# EAGLE design cortex-mpu (EAGLE 7.3.0)
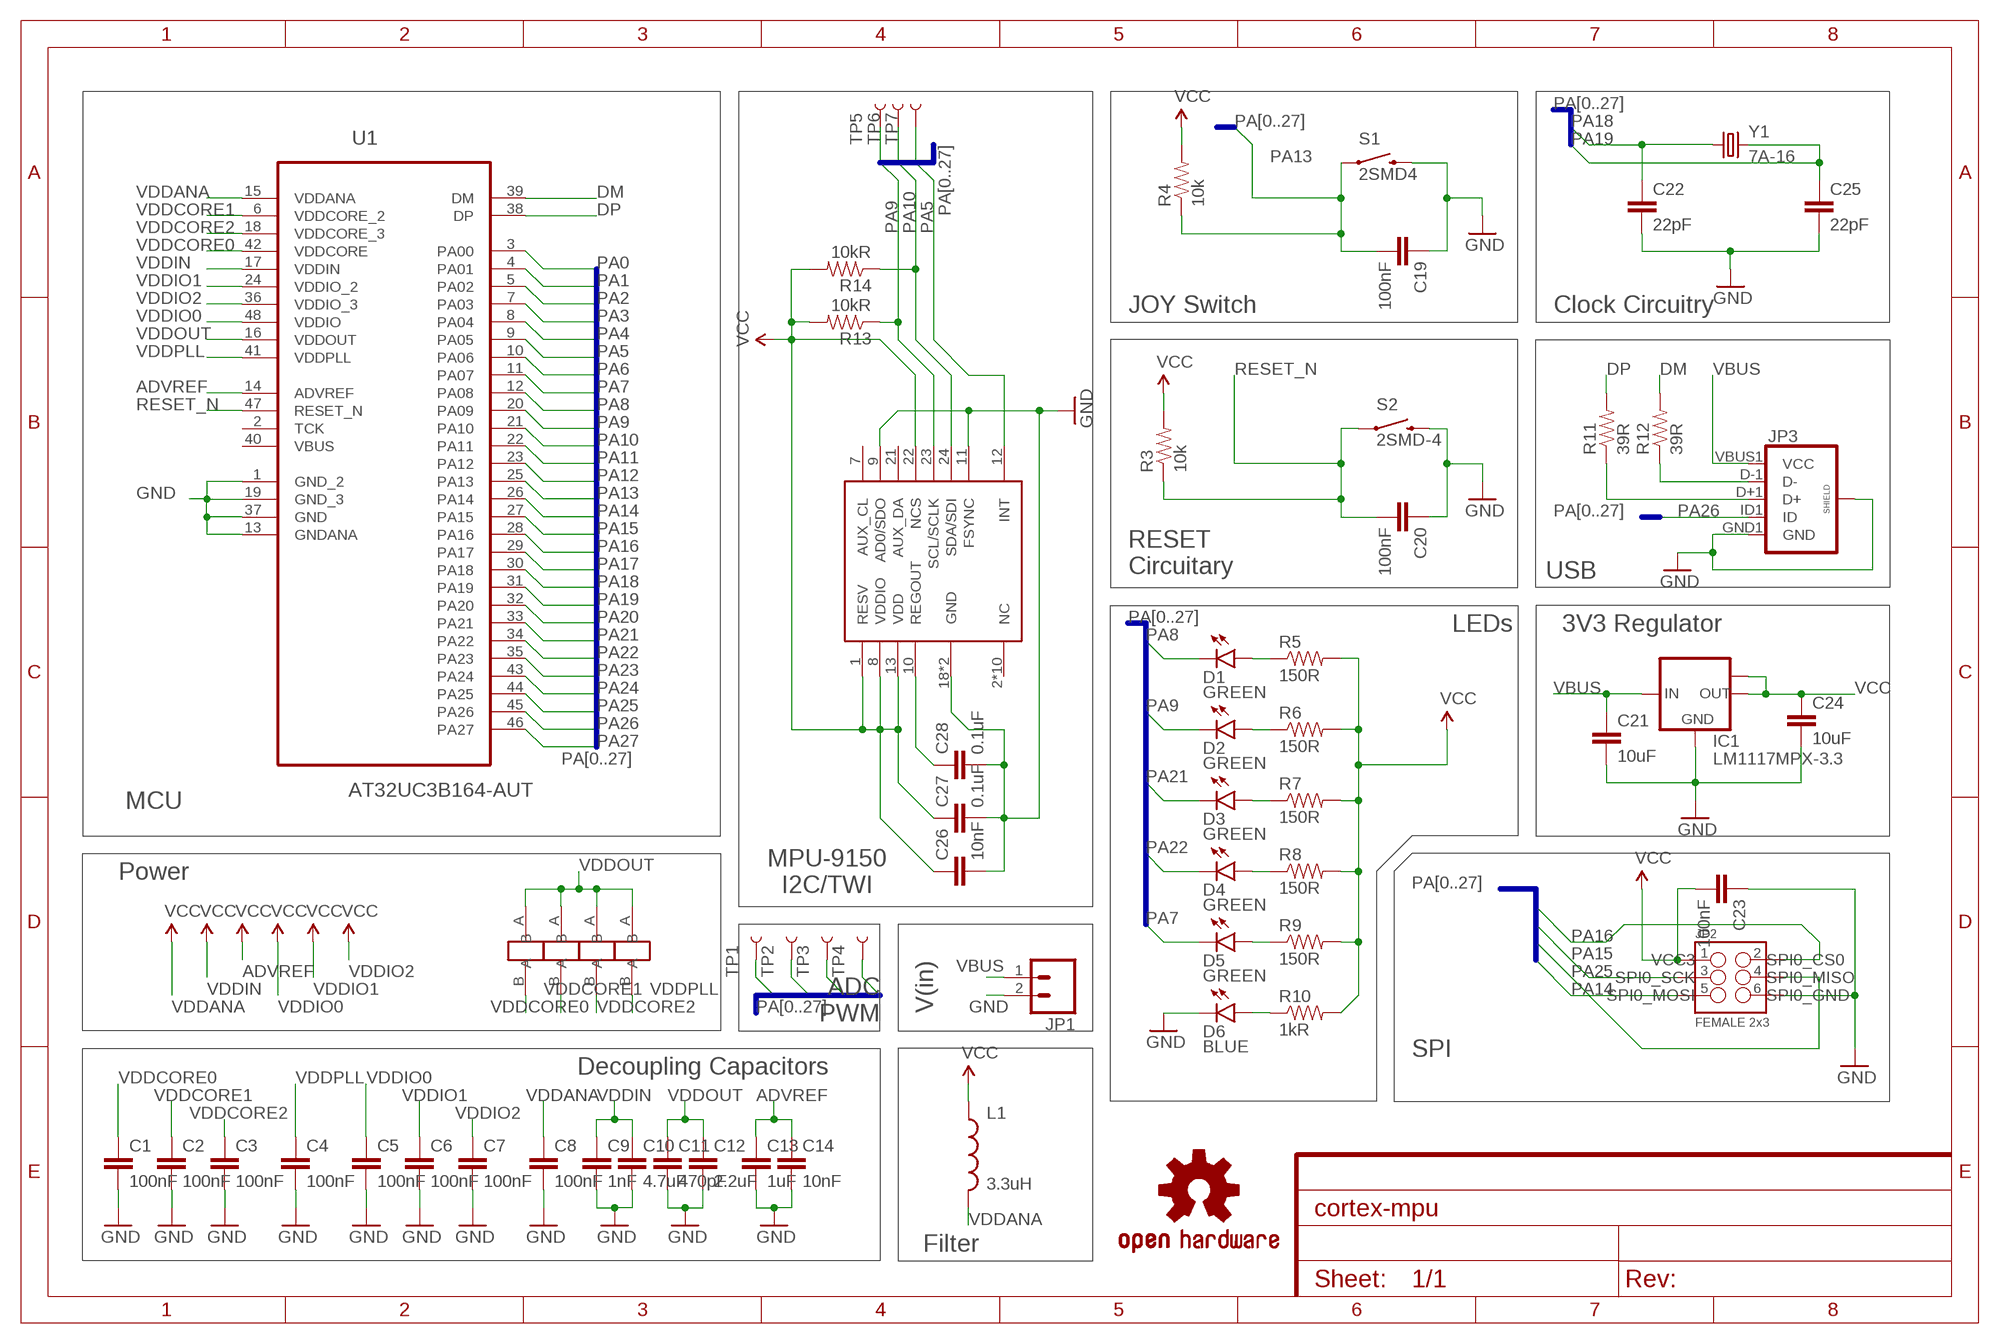
[diagram p0: schematic, sheet 1]
FRAME1 (FRAME-A4L): CNAME: AVR32 and MPU Interface; CREVISION: 1; DESIGNER: Prashant Sinha

## Parts
C1  100nF  CAP0603-CAP  [0603-CAP]
C2  100nF  CAP0603-CAP  [0603-CAP]
C3  100nF  CAP0603-CAP  [0603-CAP]
C4  100nF  CAP0603-CAP  [0603-CAP]
C5  100nF  CAP0603-CAP  [0603-CAP]
C6  100nF  CAP0603-CAP  [0603-CAP]
C7  100nF  CAP0603-CAP  [0603-CAP]
C8  100nF  CAP0603-CAP  [0603-CAP]
C9  1nF  CAP0603-CAP  [0603-CAP]
C10  4.7uF  CAP0603-CAP  [0603-CAP]
C11  470pF  CAP0603-CAP  [0603-CAP]
C12  2.2uF  CAP0603-CAP  [0603-CAP]
C13  1uF  CAP0603-CAP  [0603-CAP]
C14  10nF  CAP0603-CAP  [0603-CAP]
C19  100nF  CAP0603-CAP  [0603-CAP]
C20  100nF  CAP0603-CAP  [0603-CAP]
C21  10uF  CAP0603-CAP  [0603-CAP]
C22  22pF  CAP0603-CAP  [0603-CAP]
C23  100nF  CAP0603-CAP  [0603-CAP]
C24  10uF  CAP0603-CAP  [0603-CAP]
C25  22pF  CAP0603-CAP  [0603-CAP]
C26  10nF  CAP0603-CAP  [0603-CAP]
C27  0.1uF  CAP0603-CAP  [0603-CAP]
C28  0.1uF  CAP0603-CAP  [0603-CAP]
D1  GREEN  LED-GREEN0603  [LED-0603]
D2  GREEN  LED-GREEN0603  [LED-0603]
D3  GREEN  LED-GREEN0603  [LED-0603]
D4  GREEN  LED-GREEN0603  [LED-0603]
D5  GREEN  LED-GREEN0603  [LED-0603]
D6  BLUE  LED-BLUE0603  [LED-0603]
IC1  LM1117MPX-3.3  [SOT223]
JP1  M02LOCK  [1X02_LOCK]
JP2  FEMALE 2x3  M03X2FEMALE  [2X3]
JP3  USB_MICROB_PLUGCONN-11752  [USB-B-MICRO-SMD_V03]
L1  3.3uH  INDUCTOR0603  [0603]
LOGO1  OSHW-LOGOS-COPPER  [OSHW-LOGO-S_COPPER]
R3  10k  RESISTOR0603-RES  [0603-RES]
R4  10k  RESISTOR0603-RES  [0603-RES]
R5  150R  RESISTOR0603-RES  [0603-RES]
R6  150R  RESISTOR0603-RES  [0603-RES]
R7  150R  RESISTOR0603-RES  [0603-RES]
R8  150R  RESISTOR0603-RES  [0603-RES]
R9  150R  RESISTOR0603-RES  [0603-RES]
R10  1kR  RESISTOR0603-RES  [0603-RES]
R11  39R  RESISTOR0603-RES  [0603-RES]
R12  39R  RESISTOR0603-RES  [0603-RES]
R13  10kR  RESISTOR0603-RES  [0603-RES]
R14  10kR  RESISTOR0603-RES  [0603-RES]
S1  2SMD4  SWITCH-MOMENTARY-2SMD-4  [TACTILE_SWITCH_TALL]
S2  2SMD-4  SWITCH-MOMENTARY-2SMD-4  [TACTILE_SWITCH_TALL]
TP1  TEST-POINT2  [PAD.02X.02]
TP2  TEST-POINT2  [PAD.02X.02]
TP3  TEST-POINT2  [PAD.02X.02]
TP4  TEST-POINT2  [PAD.02X.02]
TP5  TEST-POINT2  [PAD.02X.02]
TP6  TEST-POINT2  [PAD.02X.02]
TP7  TEST-POINT2  [PAD.02X.02]
U1  AT32UC3B164-AUT  [QFP50P900X900X120-48N]
U$1  JUNCTION  [JUN-2]
U$2  JUNCTION  [JUN-2]
U$3  JUNCTION  [JUN-2]
U$4  JUNCTION  [JUN-2]
U$5  MPU-9250  [QFN-24-3MM]
Y1  7A-16  CRYSTALTXC-7A  [CRYSTAL-TXC-7A]

## Nets
ADVREF: C13.1 C14.1 U1.14(ADVREF) ; supply symbol labelled VCC
DM: R12.2 U1.39(DM)
DP: R11.2 U1.38(DP)
GND: C1.2 C2.2 C3.2 C4.2 C5.2 C6.2 C7.2 C8.2 C9.2 C10.2 C11.2 C12.2 C13.2 C14.2 C19.1 C20.1 C21.2 C22.2 C23.1 C24.2 C25.2 C26.2 C27.2 C28.2 D6.C IC1.1(GND) JP1.2 JP2.6 JP3.GND1(GND) JP3.SHIELD1(SHIELD) JP3.SHIELD2(SHIELD) JP3.SHIELD3(SHIELD) S1.B2 S2.B2 U1.1(GND_2) U1.13(GNDANA) U1.19(GND_3) U1.37(GND) U$5.9(AD0/SDO) U$5.11(FSYNC) U$5.18(GND) U$5.20(GND)
N$1: JP3.D-1(D-) R12.1
N$2: JP3.D+1(D+) R11.1
N$3: D1.A R5.1
N$4: D2.A R6.1
N$5: D6.A R10.1
N$6: D3.A R7.1
N$7: D4.A R8.1
N$8: D5.A R9.1
N$17: C28.1 U$5.10(REGOUT)
PA0: U1.3(PA00)
PA1: U1.4(PA01)
PA2: U1.5(PA02)
PA3: TP3.P$1 U1.7(PA03)
PA4: TP4.P$1 U1.8(PA04)
PA5: TP7.P$1 U1.9(PA05) U$5.12(INT)
PA6: U1.10(PA06)
PA7: D5.C U1.11(PA07)
PA8: D1.C U1.12(PA08)
PA9: D2.C R13.1 TP5.P$1 U1.20(PA09) U$5.23(SCL/SCLK)
PA10: R14.1 TP6.P$1 U1.21(PA10) U$5.24(SDA/SDI)
PA11: U1.22(PA11)
PA12: U1.23(PA12)
PA13: C19.2 R4.1 S1.A2 U1.25(PA13)
PA14: JP2.5 U1.26(PA14)
PA15: JP2.3 U1.27(PA15)
PA16: JP2.2 U1.28(PA16)
PA17: U1.29(PA17)
PA18: C22.1 U1.30(PA18) Y1.P$1
PA19: C25.1 U1.31(PA19) Y1.P$2
PA20: U1.32(PA20)
PA21: D3.C TP1.P$1 U1.33(PA21)
PA22: D4.C TP2.P$1 U1.34(PA22)
PA23: U1.35(PA23)
PA24: U1.43(PA24)
PA25: JP2.4 U1.44(PA25)
PA26: JP3.ID1(ID) U1.45(PA26)
PA27: U1.46(PA27)
RESET_N: C20.2 R3.1 S2.A2 U1.47(RESET_N)
VBUS: C21.1 IC1.3(IN) JP1.1 JP3.VBUS1(VCC)
VCC: C23.2 C24.1 C26.1 C27.1 IC1.2(OUT) IC1.TAB(OUT1) JP2.1 L1.1 R3.2 R4.2 R5.2 R6.2 R7.2 R8.2 R9.2 R10.2 R13.2 R14.2 U$5.1(RESV) U$5.8(VDDIO) U$5.13(VDD) U$5.22(NCS)
VDDANA: C8.1 L1.2 U1.15(VDDANA) ; supply symbol labelled VCC
VDDCORE0: C1.1 U1.42(VDDCORE) U$1.B
VDDCORE1: C2.1 U1.6(VDDCORE_2) U$2.B
VDDCORE2: C3.1 U1.18(VDDCORE_3) U$3.B
VDDIN: C9.1 C10.1 U1.17(VDDIN) ; supply symbol labelled VCC
VDDIO0: C5.1 U1.48(VDDIO) ; supply symbol labelled VCC
VDDIO1: C6.1 U1.24(VDDIO_2) ; supply symbol labelled VCC
VDDIO2: C7.1 U1.36(VDDIO_3) ; supply symbol labelled VCC
VDDOUT: C11.1 C12.1 U1.16(VDDOUT) U$1.A U$2.A U$3.A U$4.A
VDDPLL: C4.1 U1.41(VDDPLL) U$4.B
Unconnected: U1.2(TCK) U1.40(VBUS) U$5.2(NC) U$5.3(NC) U$5.4(NC) U$5.5(NC) U$5.6(NC) U$5.7(AUX_CL) U$5.14(NC) U$5.15(NC) U$5.16(NC) U$5.17(NC) U$5.19(NC) U$5.21(AUX_DA)

## Buses
PA[0..27]

## Notes on the sheet
- JOY Switch | Clock Circuitry
- RESET
  Circuitary
- USB
- LEDs | 3V3 Regulator
- MCU
- Power
- MPU-9150
  I2C/TWI
- VCC3 | SPI0_CS0
- ADC
  PWM
- SPI0_SCK | SPI0_MISO
- SPI0_MOSI | SPI0_GND
- V(in)
- SPI
- Decoupling Capacitors
- Filter

## Library data of the parts
C1-C14 C19-C28 = SparkFun-Passives:CAP: Capacitor Standard 0603 ceramic capacitor, and 0.1" leaded capacitor.
D1-D5 = SparkFun-LED:LED-GREEN: Various green LEDs Green LEDs used in SFE Production 0603- DIO-00821 LARGE- DIO-00862 LILYPAD- DIO-09910; PROD_ID: DIO-00821
D6 = SparkFun-LED:LED-BLUE: Blue LEDs for production use Various blue LEDs stocked by SparkFun production 0603 - DIO-08575 Rebel - DIO-09553 1206 - DIO-09911; PROD_ID: DIO-08575
IC1 = lm1117:LM1117MPX-*
JP1 = SparkFun-Connectors:M02: Standard 2-pin 0.1" header. Use with - straight break away headers ( PRT-00116) - right angle break away headers (PRT-00553) - swiss pins (PRT-00743) - machine pins (PRT-00117) - female headers (PRT-00115) Molex polarized connector foot print use with: PRT-08233 with associated crimp pins and housings. 2.54_SCREWTERM for use with PRT-10571. 3.5mm Screw Terminal footprints for PRT-08084 5mm Screw Terminal footprints for use with PRT-08432
JP2 = SparkFun-Connectors:M03X2: 2x3 .1" header. Shrouded, with keying- CONN-10681 SMT- CONN-11415 Pogo pins- HW-11044; PROD_ID: CONN-11566
JP3 = SparkFun-Connectors:USB_MICROB_PLUG: USB Micro-B connectors Some male, some female. Watch your step!; PROD_ID: CONN-11752
L1 = SparkFun-Passives:INDUCTOR: Inductors Basic Inductor/Choke - 0603 and 1206. Footprints are not proven and vary greatly between part numbers. INDUCTOR POWER 3.3UH 4.0A SMD 0.197" L x 0.197" W x 0.177" H (5.00mm x 5.00mm x 4.50mm)
LOGO1 = SparkFun-Aesthetics:OSHW-LOGO: Open Source Hardware Logo This logo indicates the piece of hardware it is found on incorporates a OSHW license and/or adheres to the definition of open source hardware found here: http://freedomdefined.org/OSHW
R3-R14 = SparkFun-Passives:RESISTOR: Resistor Basic schematic elements and footprints for 0603, 1206, and PTH resistors.
S1 S2 = SparkFun-Electromechanical:SWITCH-MOMENTARY-2: Various NO switches- pushbuttons, reed, etc; PROD_ID: SWCH-11966
TP1-TP7 = SparkFun-Passives:TEST-POINT: Bare copper test points for troubleshooting or ICT
U1 = Atmel_By_element14_Batch_1-00:AT32UC3B164-AUT: MCU; DESCRIPTION: MCU; MPN: AT32UC3B164-AUT; OC_FARNELL: 1841642; OC_NEWARK: 12T1375; PACKAGE: QFP-48; SUPPLIER: Atmel
U$1-U$4 = ANS:JUNCTION
U$5 = cortex-mpu:MPU-9250
Y1 = SparkFun-FreqCtrl:CRYSTAL: Various standard crystals. Proven footprints.

## Board
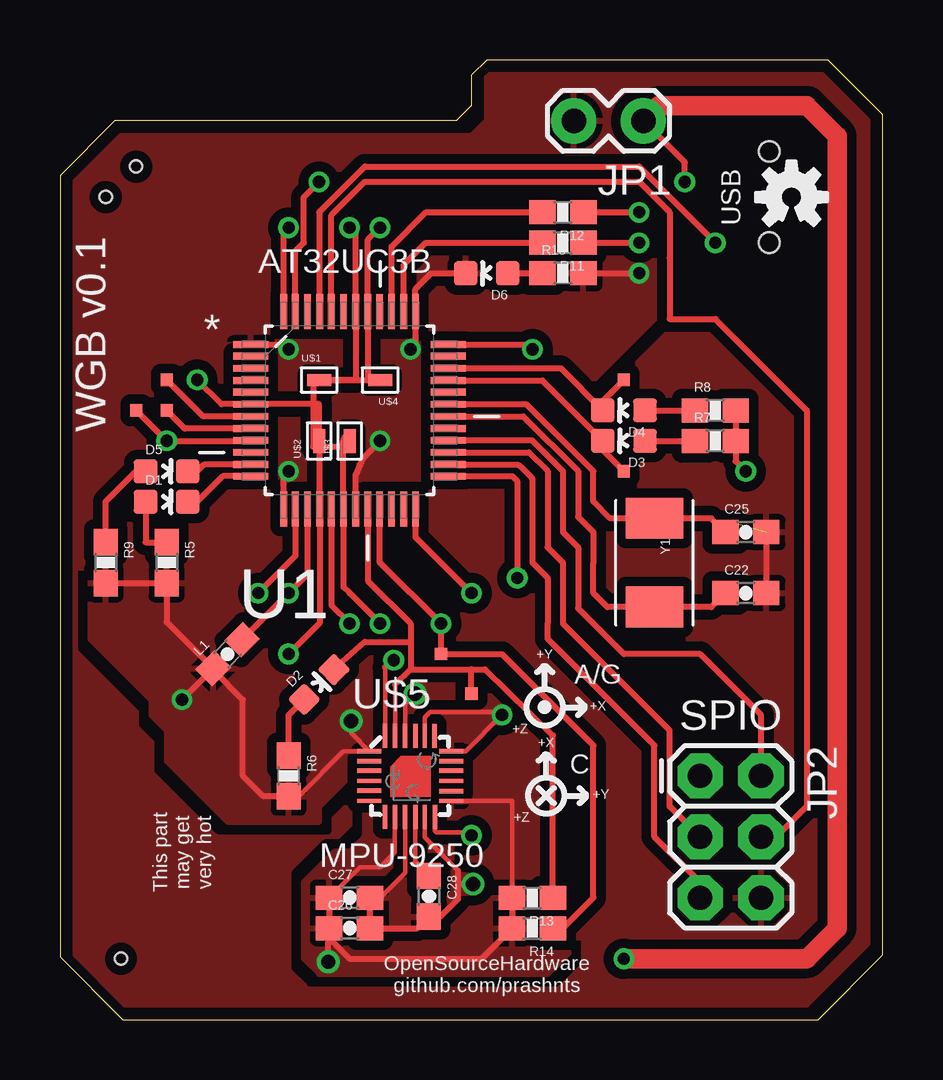
[diagram p1: board, top side]
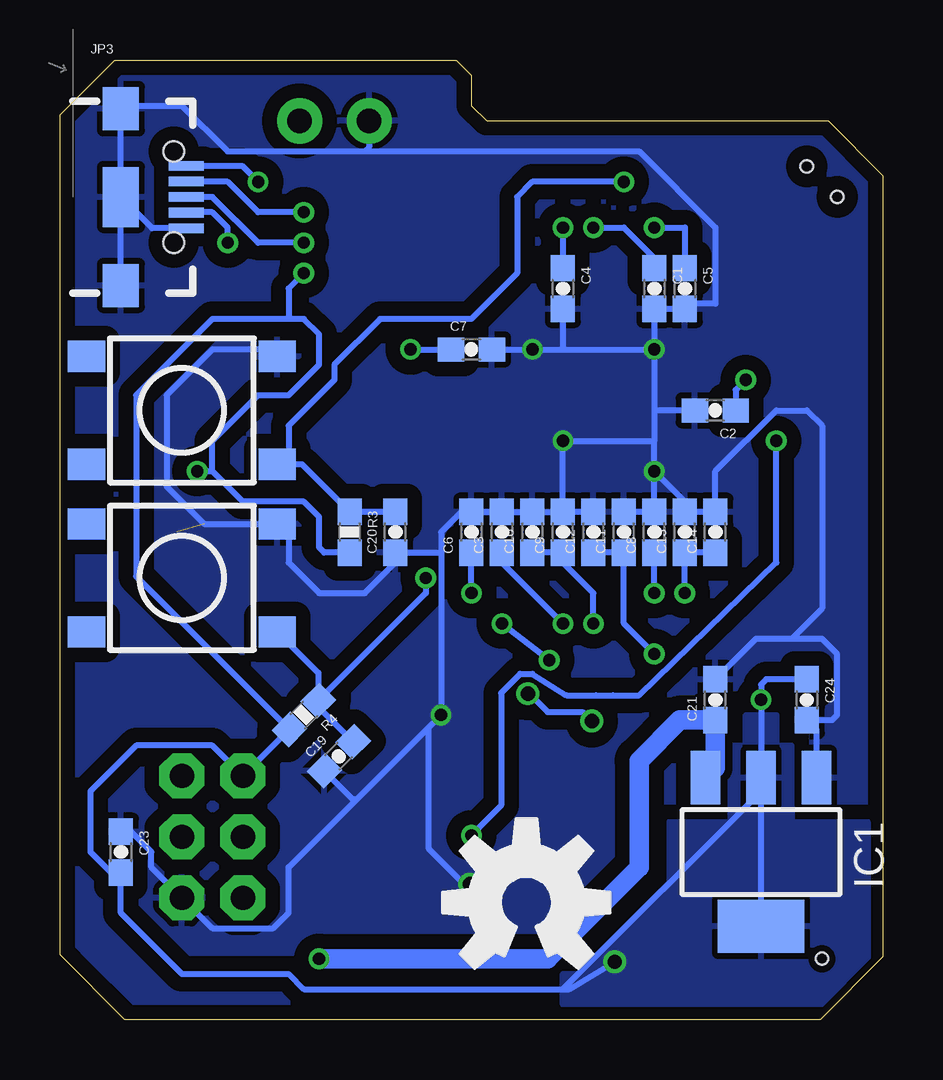
[diagram p2: board, bottom side, seen from below]

Size 34.29 x 40.01 mm. Coordinates in mm from the lower left corner, seen from the top.
Outline: 32,40.01 17.78,40.01 17.14,39.37 17.14,38.1 16.51,37.46 2.29,37.46 0,35.17 0,2.62 2.62,0 31.6,0 34.29,2.69 34.29,37.71 32,40.01
Copper layers (1*16): Top 0.035mm / dielectric 1.5mm / Bottom 0.035mm
Design rules "SparkFun-2-layer": minimum track width 7mil, minimum drill 15mil, track to track 8mil, track to pad 8mil, pad to pad 8mil, via to via 8mil, smd to smd 8mil, copper to edge 8mil, drill to drill 8mil, minimum pad ring 12mil, minimum via ring 7mil, stop-mask expansion 4mil, vias tented up to drill 20mil, thermal gap 10mil
Holes 0.51 mm at 3.17,35.56 1.91,34.29 2.54,2.54

### Footprints (pad centres in the part's own frame; a part is rotated, then mirrored left to right if it is on the bottom)
0603-CAP = smd 1.1 x 1: 1 -0.85,0; 2 0.85,0
LED-0603 = smd 1 x 1: A 0,-0.877; C 0,0.877
SOT223 = smd 1.219 x 2.235: 1 -2.311,-3.099; 2 0,-3.099; 3 2.311,-3.099 | smd 3.6 x 2.2: TAB 0,3.099
1X02_LOCK = drill 1.016 pad 1.88: 1 -0.178,0; 2 2.718,0
2X3 = drill 1.016 pad 1.88 octagon: 1 0,0; 2 0,2.54; 3 2.54,0; 4 2.54,2.54; 5 5.08,0; 6 5.08,2.54
USB-B-MICRO-SMD_V03 = smd 1.45 x 0.4: D+1 2.725,0; D-1 2.725,0.65; GND1 2.725,-1.3; ID1 2.725,-0.65; VBUS1 2.725,1.3 | smd 1.5 x 1.8: SHIELD1 0,3.685; SHIELD2 0,-3.685 | smd 1.5 x 2.5: SHIELD3 0,0 | hole 0.85: 2.2,1.9; 2.2,-1.9
0603 = smd 1.1 x 1: 1 -0.85,0; 2 0.85,0
0603-RES = smd 1.1 x 1: 1 -0.85,0; 2 0.85,0
TACTILE_SWITCH_TALL = smd 1.55 x 1.3: A1 -3.975,-2.25; A2 3.975,-2.25; B1 -3.975,2.25; B2 3.975,2.25
PAD.02X.02 = smd 0.508 x 0.508: P$1 0,0
QFP50P900X900X120-48N = smd 1.473 x 0.279: 1 -4.115,2.743; 2 -4.115,2.261; 3 -4.115,1.753; 4 -4.115,1.245; 5 -4.115,0.762; 6 -4.115,0.254; 7 -4.115,-0.254; 8 -4.115,-0.762; 9 -4.115,-1.245; 10 -4.115,-1.753; 11 -4.115,-2.261; 12 -4.115,-2.743; 25 4.115,-2.743; 26 4.115,-2.261; 27 4.115,-1.753; 28 4.115,-1.245; 29 4.115,-0.762; 30 4.115,-0.254; 31 4.115,0.254; 32 4.115,0.762; 33 4.115,1.245; 34 4.115,1.753; 35 4.115,2.261; 36 4.115,2.743 | smd 0.279 x 1.473: 13 -2.743,-4.115; 14 -2.261,-4.115; 15 -1.753,-4.115; 16 -1.245,-4.115; 17 -0.762,-4.115; 18 -0.254,-4.115; 19 0.254,-4.115; 20 0.762,-4.115; 21 1.245,-4.115; 22 1.753,-4.115; 23 2.261,-4.115; 24 2.743,-4.115; 37 2.743,4.115; 38 2.261,4.115; 39 1.753,4.115; 40 1.245,4.115; 41 0.762,4.115; 42 0.254,4.115; 43 -0.254,4.115; 44 -0.762,4.115; 45 -1.245,4.115; 46 -1.753,4.115; 47 -2.261,4.115; 48 -2.743,4.115
JUN-2 = smd 0.5 x 0.5: A -0.25,0; B 0.25,0
QFN-24-3MM = smd 1 x 0.182: 1 -1.719,1.027; 2 -1.719,0.614; 3 -1.719,0.22; 4 -1.719,-0.207; 5 -1.719,-0.62; 6 -1.719,-1.041; 13 1.692,-1.041; 14 1.692,-0.627; 15 1.692,-0.207; 16 1.692,0.22; 17 1.692,0.614; 18 1.692,1.027 | smd 0.182 x 1: 7 -1.061,-1.705; 8 -0.647,-1.705; 9 -0.227,-1.705; 10 0.2,-1.705; 11 0.593,-1.705; 12 1.014,-1.705; 19 1.007,1.665; 20 0.593,1.671; 21 0.207,1.665; 22 -0.227,1.671; 23 -0.641,1.671; 24 -1.061,1.671
CRYSTAL-TXC-7A = smd 1.7 x 2.4: P$1 1.85,0; P$2 -1.85,0

### Placement (x,y rotation side)
C1  9.53,30.48 270 bottom
C2  6.99,25.4 180 bottom
C3  15.88,20.32 90 bottom
C4  13.34,30.48 270 bottom
C5  8.25,30.48 270 bottom
C6  17.14,20.32 90 bottom
C7  17.14,27.94 0 bottom
C8  9.53,20.32 90 bottom
C9  13.34,20.32 90 bottom
C10  14.61,20.32 90 bottom
C11  10.8,20.32 90 bottom
C12  12.07,20.32 90 bottom
C13  8.25,20.32 90 bottom
C14  6.99,20.32 90 bottom
C19  22.67,10.98 45 bottom
C20  20.32,20.32 90 bottom
C21  6.99,13.34 90 bottom
C22  28.58,17.78 0 top
C23  31.75,6.99 270 bottom
C24  3.17,13.34 270 bottom
C25  28.58,20.32 0 top
C26  12.07,3.81 0 top
C27  12.07,5.08 0 top
C28  15.37,5.14 270 top
D1  4.44,21.59 270 top
D2  10.8,13.97 315 top
D3  23.5,24.13 90 top
D4  23.5,25.4 90 top
D5  4.44,22.86 270 top
D6  17.78,31.11 90 top
IC1  5.08,6.99 180 bottom
JP1  24.13,37.46 180 top
JP2  26.67,10.16 270 top
JP3  31.75,34.29 0 bottom
L1  6.99,15.24 45 top
LOGO1  30.48,34.29 0 top
R3  22.23,20.32 270 bottom
R4  24.13,12.7 225 bottom
R5  4.44,19.05 270 top
R6  9.53,10.16 270 top
R7  27.3,24.13 0 top
R8  27.3,25.4 0 top
R9  1.91,19.05 270 top
R10  20.96,31.11 0 top
R11  20.96,32.38 180 top
R12  20.96,33.66 180 top
R13  19.69,5.08 180 top
R14  19.69,3.81 180 top
S1  29.21,18.41 0 bottom
S2  29.21,25.4 0 bottom
TP1  23.5,22.86 0 top
TP2  23.5,26.67 0 top
TP3  4.44,26.67 0 top
TP4  4.44,25.4 0 top
TP5  17.14,13.59 0 top
TP6  15.88,15.24 0 top
TP7  3.17,25.4 0 top
U1  12.07,25.4 0 top
U$1  10.8,26.67 0 top
U$2  10.8,24.13 90 top
U$3  12.07,24.13 90 top
U$4  13.34,26.67 180 top
U$5  14.61,10.16 0 top
U$6  [OSHW-LOGO-L]  14.86,4.89 0 bottom
U$7  [OSHW-LOGO-S]  30.48,34.29 0 top
Y1  24.77,19.05 270 top

### Tracks (layer width: path | path; a pad name or v marks a point on that pad's centre or on a via)
ADVREF  (via drill 0.51)
  Top 0.254: U1.14 9.8,19.33 9.53,19.05 v8.25,17.78
  Bottom 0.254: C14.1 C13.1 v8.25,17.78
DM
  Top 0.254: U1.39 13.82,32.23 15.24,33.66 R12.2
DP
  Top 0.254: U1.38 14.33,31.47 15.24,32.38 R11.2
GND  (via drill 0.51, 0.6)  (1 unrouted)
  Top 0.178: 13.34,5.08 14.38,6.12 U$5.9 | v18.41,12.7 16.9,11.19 U$5.18 | U$5.20 15.2,12.59 15.43,12.83 18.29,12.83 | U$5.11 15.2,7.6 16.57,6.22
  Top 0.254: U1.1 9.32,28.14 v9.53,27.94 | U1.13 9.32,22.66 v9.53,22.86 | U1.19 12.32,22.68 12.63,23.42 v13.34,24.13 | v14.61,27.94 14.81,28.14 U1.37 14.81,30.45 15.48,31.11 D6.C | C25.2 C22.2 | 18.29,12.83 v18.41,12.7 | 16.57,5.65 16.57,5.02 15.85,4.29 C28.2 14.88,3.81 C26.2 C27.2 13.34,5.08 | 16.57,6.22 16.57,5.65 | 16.57,5.65 v17.21,5.65
  Bottom 0.254: v9.53,27.94 9.53,25.4 | 9.53,25.4 9.53,24.13 | v9.53,22.86 9.53,24.13 | 9.53,24.13 v13.34,24.13 C9.2 | 13.34,27.94 v14.61,27.94 C7.2 | 13.34,27.94 v9.53,27.94 | C4.2 13.34,27.94 | v9.53,27.94 C1.2 C5.2 8.04,29.84 6.99,29.84 6.99,33.02 10.16,36.2 21.59,36.2 | C2.2 9.53,25.4 | v9.53,22.86 8.25,21.59 C13.2 C14.2 6.99,22.86 4.44,25.4 3.17,25.4 2.54,24.77 2.54,17.14 3.81,15.88 | C6.2 C3.2 | C3.2 C10.2 C9.2 | C11.2 C8.2 v9.53,22.86 | C12.2 C9.2 | C3.2 17.57,21.17 18.41,20.32 18.41,19.47 | 18.41,19.47 v18.41,12.7 | 21.91,9.21 24.77,6.35 24.77,4.45 25.4,3.81 27.94,3.81 JP2.6 30.48,6.35 30.48,6.99 31.33,7.83 C23.1 | 21.91,9.21 v18.41,12.7 | C19.1 22.1,9.21 21.91,9.21 | S1.B2 24.77,20.2 24.77,19.05 23.5,17.78 21.59,17.78 20.32,19.05 C20.1 18.41,19.47 | 25.23,20.79 S1.B2 | S2.B2 25.52,27.94 27.94,27.94 29.84,26.04 29.84,22.22 28.29,20.66 S1.B2 | JP3.GND1 30.45,32.99 JP3.SHIELD3 | JP3.SHIELD3 JP3.SHIELD1 | JP3.SHIELD3 JP3.SHIELD2 31.75,38.1 29.21,38.1 27.3,36.2 21.59,36.2 | JP1.2 21.41,36.37 21.59,36.2 | IC1.1 2.77,12.08 C24.2 2.12,12.48 1.91,12.7 1.91,15.24 2.54,15.88 3.81,15.88 | 3.81,15.88 5.29,15.88 C21.2 | v17.21,5.65 17.46,5.65 18.92,7.11 18.92,12.19 v18.41,12.7
  pour Bottom (isolate 0.61, rank 3): 0.63,34.92 2.54,36.83 16.51,36.83 17.78,38.1 17.78,39.37 31.75,39.37 33.66,37.46 33.66,3.17 33.02,2.54 31.12,0.64 3.17,0.64 2.54,0.64 0.63,2.54
  pour Top (isolate 0.406, rank 3): 2.54,36.83 0.63,34.92 0.63,2.54 2.54,0.64 31.12,0.64 33.66,3.17 33.66,37.46 31.75,39.37 17.78,39.37 17.78,38.1 17.78,37.46 17.14,36.83
N$1  (via drill 0.51)
  Top 0.254: R12.1 v24.13,33.66
  Bottom 0.254: v24.13,33.66 26.04,33.66 27.3,34.92 29.01,34.92 JP3.D-1
N$2  (via drill 0.51)
  Top 0.254: R11.1 v24.13,32.38
  Bottom 0.254: v24.13,32.38 26.04,32.38 27.94,34.29 JP3.D+1
N$3
  Top 0.254: D1.A 3.57,19.9 R5.1
N$4
  Top 0.254: R6.1 9.53,12.7 D2.A
N$5
  Top 0.254: D6.A R10.1
N$6
  Top 0.254: D3.A R7.1
N$7
  Top 0.254: D4.A R8.1
N$8
  Top 0.254: R9.1 1.91,21.59 3.17,22.86 D5.A
N$17
  Top 0.178: U$5.10 14.8,6.56
  Top 0.254: 14.8,6.56 C28.1
PA3
  Top 0.254: U1.7 5.97,25.15 TP3.P$1
PA4
  Top 0.254: U1.8 5.21,24.64 TP4.P$1
PA5  (via drill 0.51)
  Top 0.178: U$5.12 15.62,7.88 15.68,7.81 17.02,7.81
  Top 0.254: U1.9 7.92,24.13 v4.44,24.13 TP7.P$1 | 17.02,7.81 v17.14,7.68
  Bottom 0.254: v4.44,24.13 4.44,19.05 10.16,13.53 11.25,13.52 11.95,13.52 13.2,13.52 14.61,14.41 15.11,14.41 15.91,13.61 15.91,8.92 v17.14,7.68
PA7
  Top 0.254: U1.11 5.99,23.14 5.71,22.86 D5.C
PA8
  Top 0.254: U1.12 6.78,22.66 5.71,21.59 D1.C
PA9
  Top 0.178: U$5.23 13.96,13.96
  Top 0.254: U1.20 12.83,18.29 14.61,16.51 14.61,15.75 | 14.61,14.61 17.14,14.61 | 17.14,14.61 17.72,14.61 20.54,11.85 R13.1 | TP5.P$1 17.14,14.61 | 14.61,15.75 14.61,14.61 | D2.C 12.7,15.75 14.61,15.75 | 13.96,13.96 14.61,14.61
PA10  (via drill 0.51)
  Top 0.178: U$5.24 13.54,14.69
  Top 0.254: U1.21 13.31,19.07 v15.88,16.51 TP6.P$1 18.41,15.24 22.23,11.43 22.23,5.08 20.96,3.81 R14.1 | 13.54,14.69 v13.91,14.99
  Bottom 0.254: v15.88,16.51 v13.91,14.99
PA13  (via drill 0.51)
  Top 0.254: U1.25 18.85,22.66 19.05,22.45 v19.05,18.41
  Bottom 0.254: C19.2 23.53,13.04 R4.1 | S1.A2 23.53,14.46 R4.1 | v19.05,18.41 19.05,17.78 R4.1
PA14
  Top 0.254: U1.26 19.08,23.14 19.12,23.12 19.22,23.03 19.32,22.94 19.57,22.69 19.69,22.55 19.69,19.05 20.32,18.41 20.32,16.51 20.32,15.88 22.23,13.97 24.77,11.43 24.77,7.62 26.67,5.71 JP2.5
PA15
  Top 0.254: U1.27 19.53,23.65 20.32,22.86 20.32,19.68 20.96,19.05 20.96,16.51 25.4,12.07 25.4,8.89 JP2.3
PA16
  Top 0.254: U1.28 19.66,24.15 20.96,22.86 20.96,20.32 21.59,19.68 21.59,17.14 23.5,15.24 26.67,15.24 29.21,12.7 JP2.2
PA18
  Top 0.254: C22.1 27.15,17.2 Y1.P$1 22.8,17.2 22.23,17.78 22.23,19.05 22.23,20.32 21.59,20.95 21.59,22.86 19.3,25.15 U1.30
PA19
  Top 0.254: C25.1 27.15,20.9 Y1.P$2 22.91,20.9 22.23,21.59 22.23,22.86 19.43,25.65 U1.31
PA21
  Top 0.254: U1.33 20.1,26.64 D3.C 22.62,23.74 TP1.P$1
PA22
  Top 0.254: U1.34 20.87,27.15 D4.C 22.62,25.79 TP2.P$1
PA25
  Top 0.254: JP2.4 29.84,7.62 31.12,8.89 31.12,25.4 27.3,29.21 25.4,29.21 25.4,31.75 25.4,33.66 24.13,34.92 12.7,34.92 11.3,33.53 U1.44
PA26  (via drill 0.51)
  Top 0.254: U1.45 10.82,33.63 10.8,33.66 12.7,35.56 24.13,35.56 v27.3,32.38
  Bottom 0.254: v27.3,32.38 27.3,33.02 27.94,33.66 29.01,33.66 JP3.ID1
RESET_N  (via drill 0.51)
  Top 0.254: U1.47 9.8,32.03 10.16,32.38 10.16,34.29 v10.8,34.92
  Bottom 0.254: C20.2 R3.1 24.21,23.15 S2.A2 24.77,23.62 24.77,24.77 22.86,26.67 22.86,27.3 20.96,29.21 17.14,29.21 15.24,31.11 15.24,34.29 14.61,34.92 v10.8,34.92
VBUS  (via drill 0.51)
  Top 0.254: v26.04,34.92 26.04,35.74 JP1.1
  Top 0.813: v23.5,2.54 31.12,2.54 32.38,3.81 32.38,36.83 31.12,38.1 24.94,38.1 JP1.1
  Bottom 0.254: JP3.VBUS1 26.7,35.59 v26.04,34.92 | 6.99,10.49 IC1.3
  Bottom 0.813: 6.99,10.49 C21.1 8.47,12.48 10.16,10.8 10.16,6.35 13.97,2.54 v23.5,2.54
VCC  (via drill 0.51, 0.6)
  Top 0.178: C27.1 12.48,6.35 13.34,6.35 13.96,6.97 U$5.8 | 9.95,9.31 11.81,11.18 12.45,11.18 U$5.1 12.13,11.95 v12.13,12.45 | U$5.13 18.84,9.12 R13.2 | U$5.22 14.38,13.17 v14.8,13.59
  Top 0.254: C27.1 C26.1 | C26.1 10.8,3.81 12.07,2.54 17.57,2.54 R14.2 R13.2 | R8.2 R7.2 28.16,23.28 v28.58,22.86 | 9.95,9.31 R6.2 8.47,9.31 7.62,10.16 7.62,13.34 6.38,14.57 | R9.2 R5.2 4.44,16.58 L1.1 6.38,14.57 | R10.2 v24.13,31.11 | 6.38,14.57 6.32,14.57 v5.08,13.34 | v11.18,2.41 11.18,3.09 C26.1
  Bottom 0.254: R3.2 23.28,19.47 23.5,19.68 23.5,20.95 24.13,21.59 26.67,21.59 27.94,22.86 | 27.94,22.86 27.94,24.13 26.04,26.04 24.77,26.04 23.5,27.3 23.5,28.57 24.13,29.21 24.77,29.21 | 24.77,29.21 27.94,29.21 31.12,26.04 31.12,18.48 R4.2 JP2.1 27.94,11.43 31.12,11.43 33.02,9.53 33.02,6.99 32.17,6.13 C23.2 31.75,4.45 29.21,1.91 24.77,1.91 24.13,1.27 13.34,1.27 | v28.58,22.86 27.94,22.86 | v24.13,31.11 24.77,30.48 24.77,29.21 | IC1.TAB 5.08,9.53 | 5.08,9.53 IC1.2 v5.08,13.34 5.08,13.97 4.86,14.18 C24.1 | 13.34,1.27 5.08,9.53 | 13.34,1.27 13.08,1.27 v11.18,2.41 | v14.8,13.59 14.73,13.59 13.97,12.83 12.51,12.83 v12.13,12.45
  pour Bottom (isolate 0.305): 4.44,12.7 4.44,11.43 3.81,11.43 3.81,8.25 1.91,8.25 0.63,8.25 0.63,2.54 2.54,0.64 13.34,0.64 13.34,1.91 12.7,1.91 9.53,5.08 8.89,5.71 8.89,8.25 6.35,8.25 6.35,11.43 5.71,11.43 5.71,12.7
  pour Top (isolate 0.406): 7.62,31.11 6.99,31.11 5.71,29.84 3.17,27.3 1.91,26.04 1.91,21.59 1.27,20.95 1.27,16.51 1.27,15.88 3.81,13.34 3.81,12.7 4.44,12.07 4.44,10.8 6.99,8.25 10.8,8.25 10.8,8.89 12.07,10.16 12.7,10.16 12.7,7.62 12.07,6.99 11.43,6.99 10.16,5.71 10.16,2.54 10.8,1.91 19.05,1.91 20.32,1.91 23.5,5.08 23.5,11.43 22.86,12.07 18.41,16.51 18.41,23.49 21.59,26.67 22.23,26.67 24.77,29.21 24.77,34.29 10.8,34.29
VDDANA  (via drill 0.51)
  Top 0.254: U1.15 10.31,18.57 v9.53,17.78 L1.2
  Bottom 0.254: v9.53,17.78 C8.1
VDDCORE0  (via drill 0.51)
  Top 0.254: U$1.B 12.32,26.67 U1.42 12.32,32.77 v12.07,33.02
  Bottom 0.254: v12.07,33.02 10.8,33.02 9.53,31.75 C1.1
VDDCORE1  (via drill 0.51)
  Top 0.254: U$2.B 10.8,25.65 U1.6 6.73,25.65 v5.71,26.67
  Bottom 0.254: v5.71,26.67 6.13,26.25 C2.1
VDDCORE2  (via drill 0.51)
  Top 0.254: 12.07,24.13 U$3.B arc90 11.81,24.13 U1.18 11.81,18.03 12.07,17.78 v13.34,16.51
  Bottom 0.254: v13.34,16.51 15.88,19.05 C3.1
VDDIN  (via drill 0.51)
  Top 0.254: U1.17 11.3,17.27 v12.07,16.51
  Bottom 0.254: C10.1 C9.1 13.34,19.05 12.07,17.78 v12.07,16.51
VDDIO0  (via drill 0.51)
  Top 0.254: U1.48 9.32,32.82 v9.53,33.02
  Bottom 0.254: v9.53,33.02 8.25,33.02 C5.1
VDDIO1  (via drill 0.51)
  Top 0.254: U1.24 14.81,20.12 v17.14,17.78
  Bottom 0.254: v17.14,17.78 C6.1
VDDIO2  (via drill 0.51)
  Top 0.254: U1.36 19.48,28.14 v19.69,27.94
  Bottom 0.254: v19.69,27.94 C7.1
VDDOUT  (via drill 0.51)
  Top 0.254: U$4.A U$1.A 10.55,23.88 U$2.A | U$3.A U$2.A | U1.16 10.82,23.86 arc90 U$2.A | U1.16 10.82,21.56 10.8,21.59 | U1.16 10.82,16.54 v9.53,15.24
  Bottom 0.254: C12.1 C11.1 10.8,16.51 v9.53,15.24
VDDPLL  (via drill 0.51)
  Top 0.254: U$4.B 12.83,26.67 U1.41 12.83,32.51 v13.34,33.02
  Bottom 0.254: v13.34,33.02 C4.1

### Text on the board
tPlace: USB | AT32UC3B | WGB v0.1 | +Y | A/G | +X | +Z | SPIO | +X | C | +Y | +Z | This part / may get / very hot | MPU-9250 | OpenSourceHardware / github.com/prashnts
Name: GND | 5v